# EAGLE design Gadget-Box-teensy-modules (EAGLE 6.6.0)

## Sheet 1 of 2
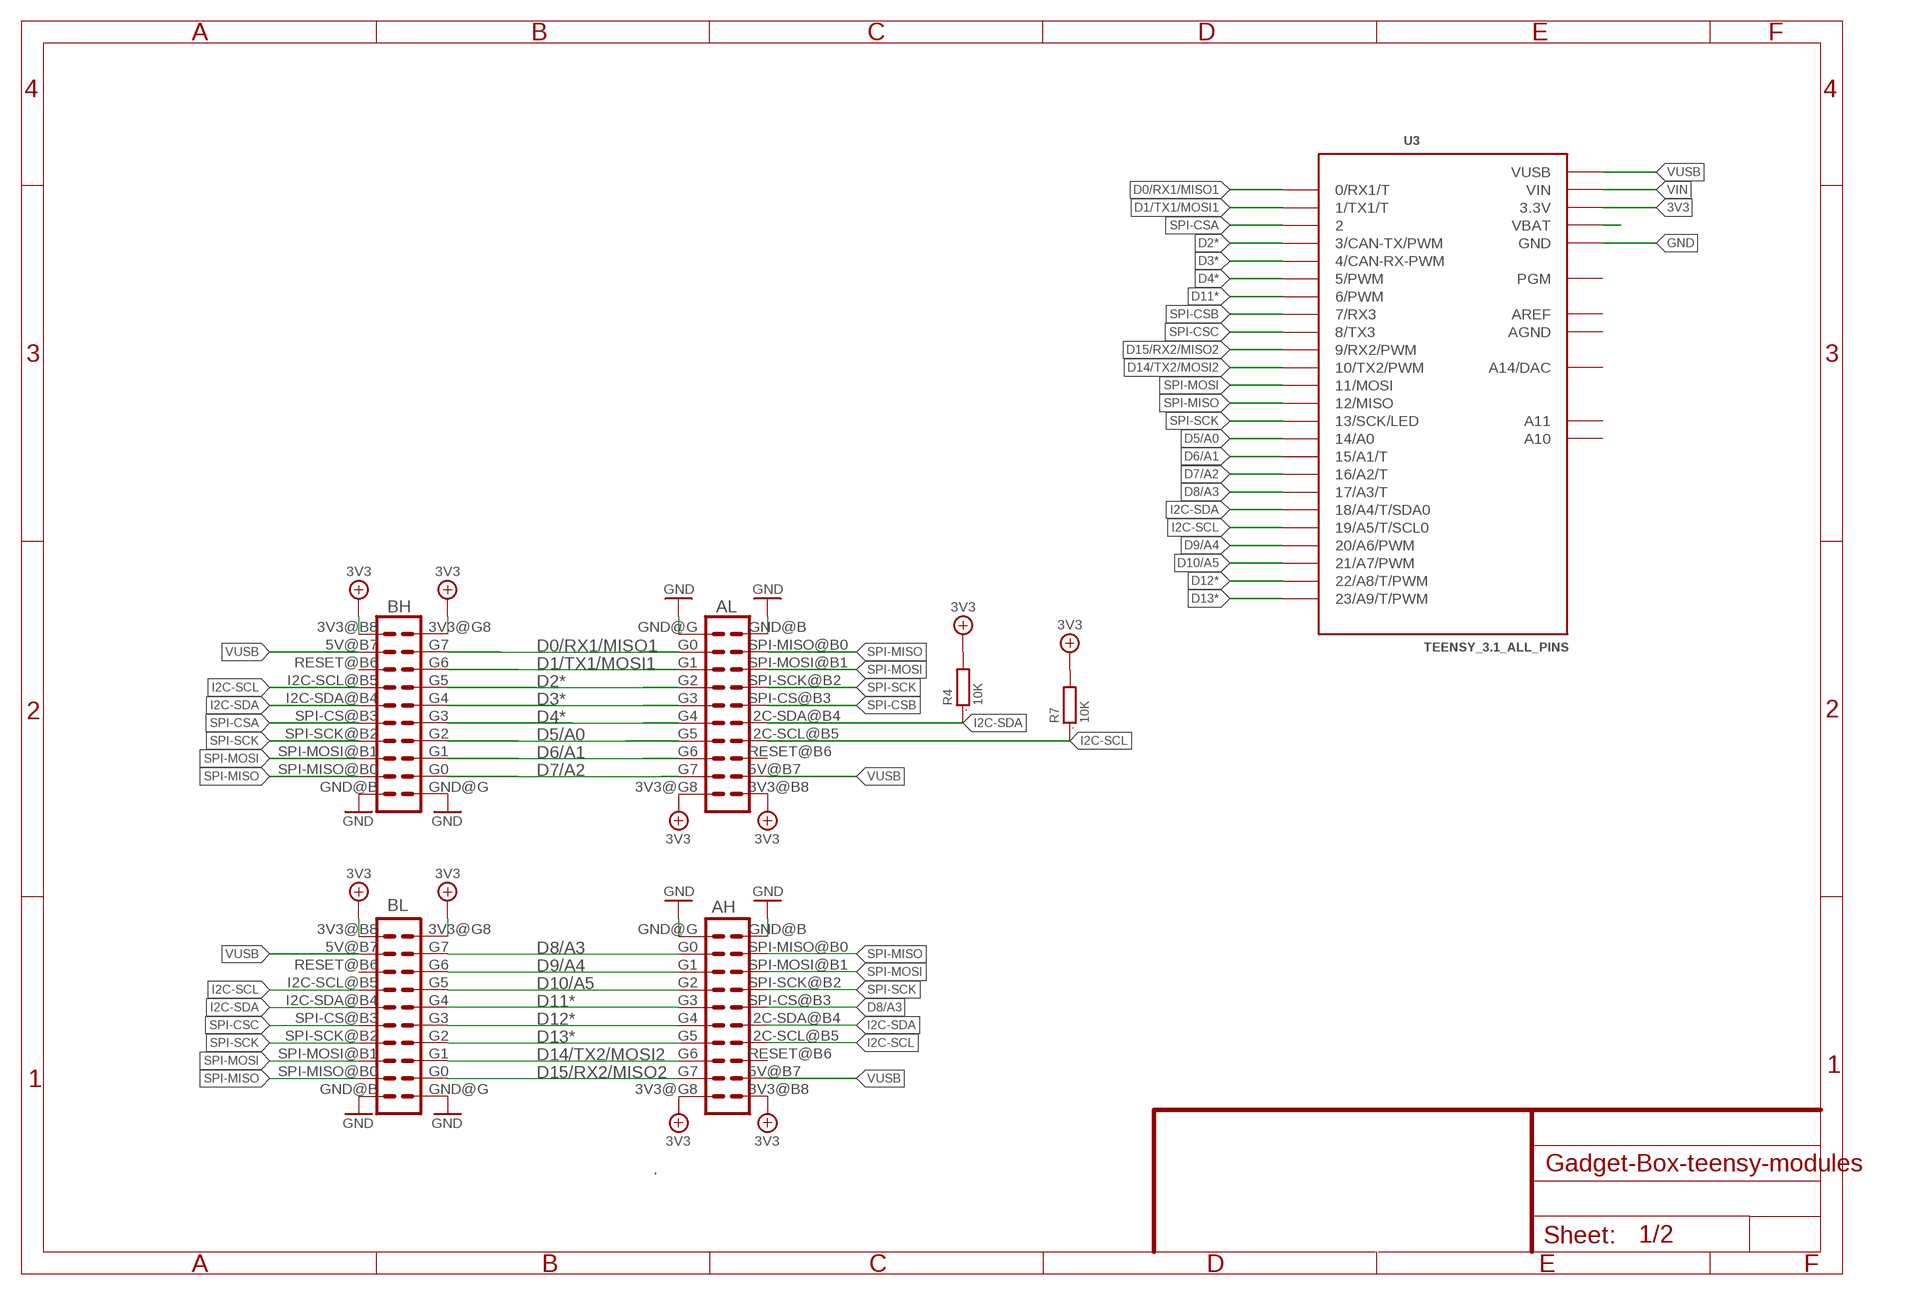
[diagram p0: schematic, sheet 1]

### Parts
AH  ECOGECOG_SLOT_ALT1  [ECOG_ALT1]
AL  ECOGECOG_SLOT_ALT1  [ECOG_ALT1]
BH  ECOGECOG_SLOT_ALT1  [ECOG_ALT1]
BL  ECOGECOG_SLOT_ALT1  [ECOG_ALT1]
R4  10K  R0603  [0603]
R7  10K  R0603  [0603]
U3  TEENSY_3.1_ALL_PINS  [TEENSY3-ALL_PINS]

### Nets
3V3: AH.3V3@B8(3V3) AH.3V3@G8(3V3) AL.3V3@B8(3V3) AL.3V3@G8(3V3) BH.3V3@B8(3V3) BH.3V3@G8(3V3) BL.3V3@B8(3V3) BL.3V3@G8(3V3) R4.2 R7.2 U3.3.3V U3.3.3V1(3.3V)
D0/RX1/MISO1: AL.G0 BH.G7 U3.0(0/RX1/T)
D1/TX1/MOSI1: AL.G1 BH.G6 U3.1(1/TX1/T)
D2*: AL.G2 BH.G5 U3.3(3/CAN-TX/PWM)
D3*: AL.G3 BH.G4 U3.4(4/CAN-RX-PWM)
D4*: AL.G4 BH.G3 U3.5(5/PWM)
D5/A0: AL.G5 BH.G2 U3.14/A0 ; also sheet 2
D6/A1: AL.G6 BH.G1 U3.15/A1(15/A1/T)
D7/A2: AL.G7 BH.G0 U3.16/A2(16/A2/T)
D8/A3: AH.G0 AH.SPI-CS@B3(SPI-CS) BL.G7 U3.17/A3(17/A3/T)
D9/A4: AH.G1 BL.G6 U3.20/A6(20/A6/PWM)
D10/A5: AH.G2 BL.G5 U3.21/A7(21/A7/PWM)
D11*: AH.G3 BL.G4 U3.6(6/PWM)
D12*: AH.G4 BL.G3 U3.22/A8(22/A8/T/PWM)
D13*: AH.G5 BL.G2 U3.23/A9(23/A9/T/PWM)
D14/TX2/MOSI2: AH.G6 BL.G1 U3.10(10/TX2/PWM)
D15/RX2/MISO2: AH.G7 BL.G0 U3.9(9/RX2/PWM)
GND [gnd]: AH.GND@B(GND) AH.GND@G(GND) AL.GND@B(GND) AL.GND@G(GND) BH.GND@B(GND) BH.GND@G(GND) BL.GND@B(GND) BL.GND@G(GND) U3.GND U3.GND1(GND) ; also sheet 2
I2C-SCL: AH.I2C-SCL@B5(I2C-SCL) AL.I2C-SCL@B5(I2C-SCL) BH.I2C-SCL@B5(I2C-SCL) BL.I2C-SCL@B5(I2C-SCL) R7.1 U3.19/A5(19/A5/T/SCL0)
I2C-SDA: AH.I2C-SDA@B4(I2C-SDA) AL.I2C-SDA@B4(I2C-SDA) BH.I2C-SDA@B4(I2C-SDA) BL.I2C-SDA@B4(I2C-SDA) R4.1 U3.18/A4(18/A4/T/SDA0)
SPI-CSA: BH.SPI-CS@B3(SPI-CS) U3.2
SPI-CSB: AL.SPI-CS@B3(SPI-CS) U3.7(7/RX3)
SPI-CSC: BL.SPI-CS@B3(SPI-CS) U3.8(8/TX3)
SPI-MISO: AH.SPI-MISO@B0(SPI-MISO) AL.SPI-MISO@B0(SPI-MISO) BH.SPI-MISO@B0(SPI-MISO) BL.SPI-MISO@B0(SPI-MISO) U3.12(12/MISO)
SPI-MOSI: AH.SPI-MOSI@B1(SPI-MOSI) AL.SPI-MOSI@B1(SPI-MOSI) BH.SPI-MOSI@B1(SPI-MOSI) BL.SPI-MOSI@B1(SPI-MOSI) U3.11(11/MOSI)
SPI-SCK: AH.SPI-SCK@B2(SPI-SCK) AL.SPI-SCK@B2(SPI-SCK) BH.SPI-SCK@B2(SPI-SCK) BL.SPI-SCK@B2(SPI-SCK) U3.13(13/SCK/LED)
VBAT: U3.VBAT
VIN: U3.VIN ; also sheet 2
VUSB: AH.5V@B7(5V) AL.5V@B7(5V) BH.5V@B7(5V) BL.5V@B7(5V) U3.VUSB ; also sheet 2
Unconnected: AH.RESET@B6(RESET) AL.RESET@B6(RESET) BH.RESET@B6(RESET) BL.RESET@B6(RESET) U3.A10 U3.A11 U3.PGM U3.RESET/DAC(A14/DAC)

## Sheet 2 of 2
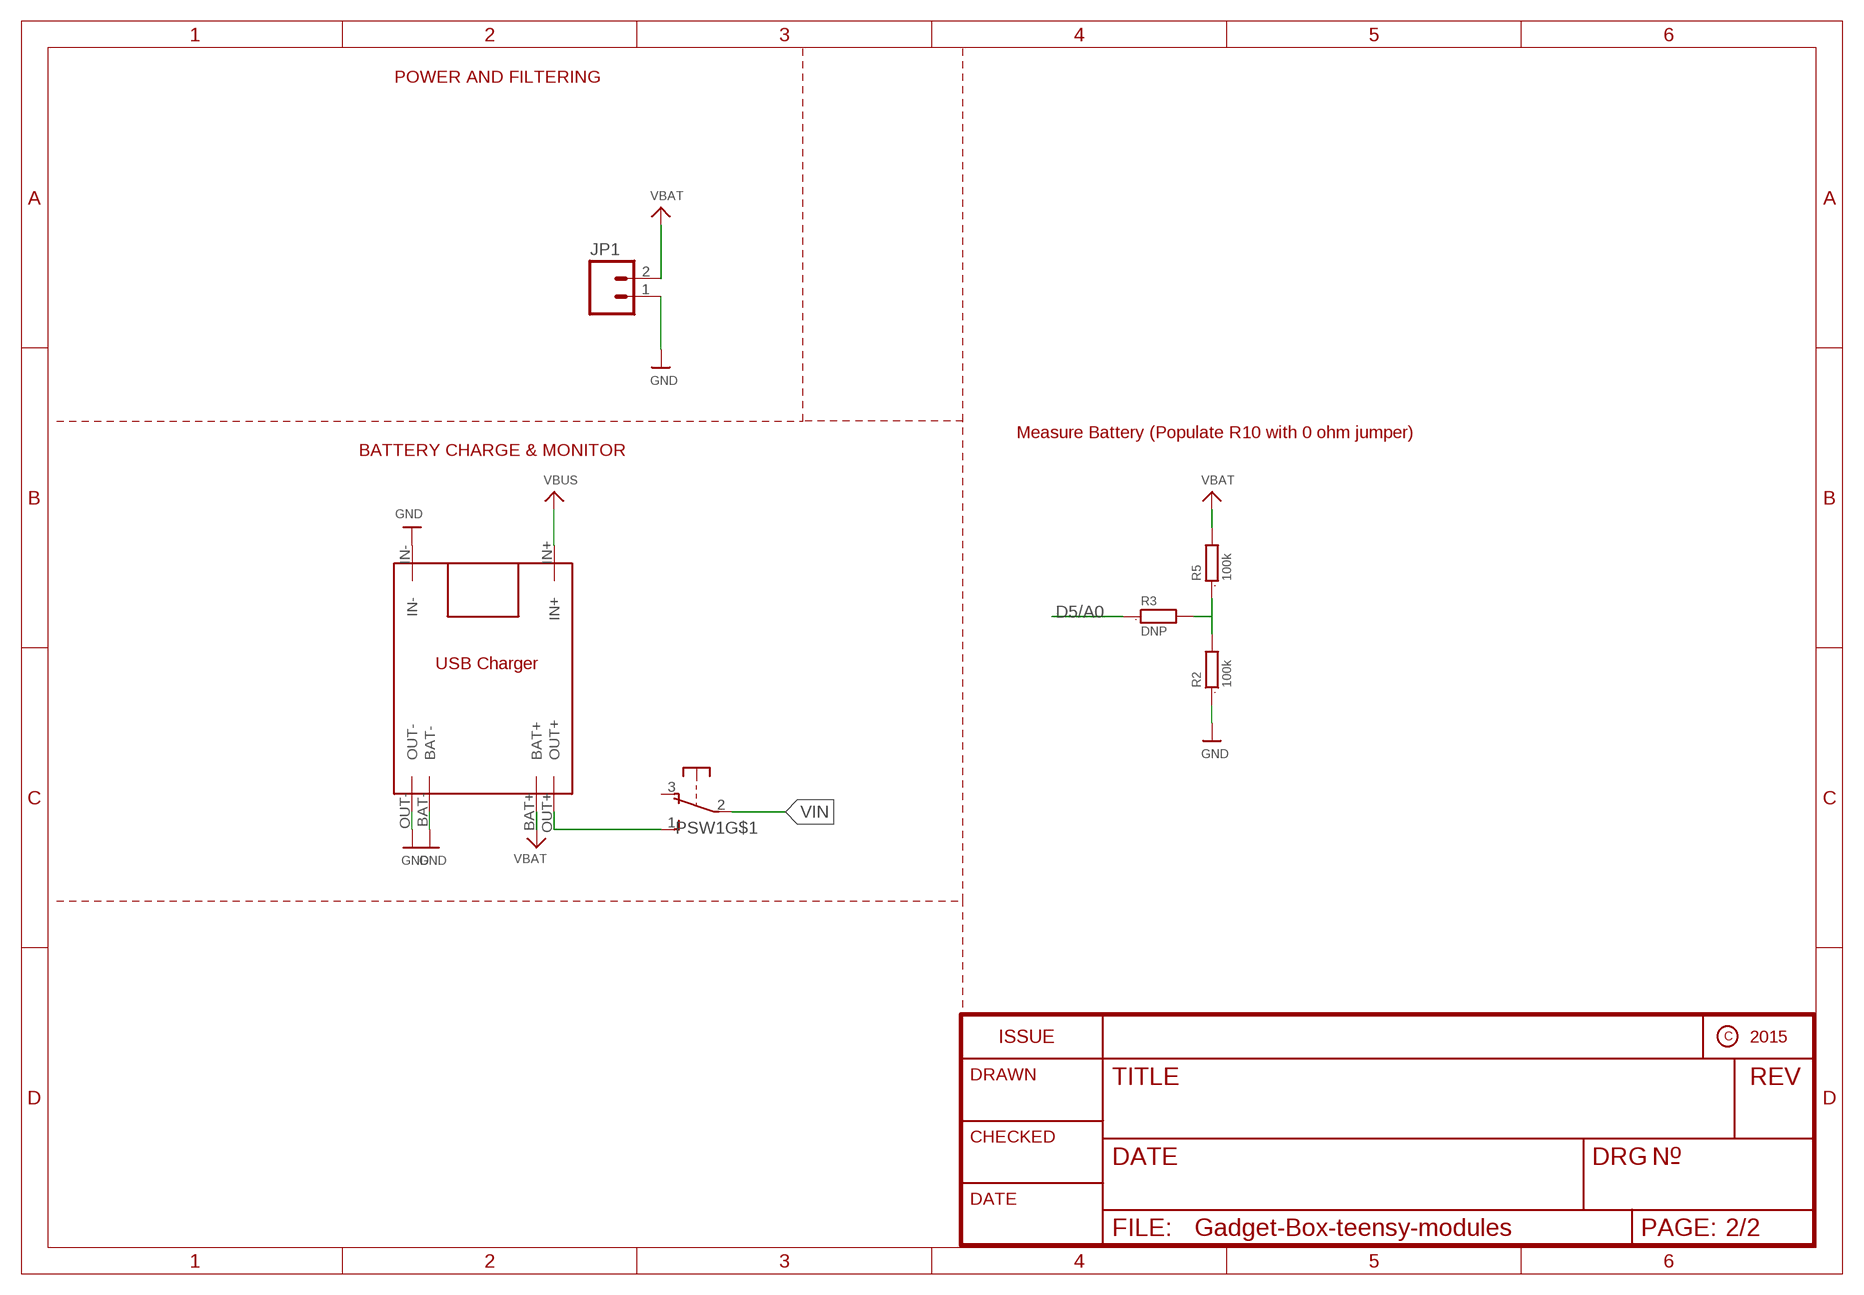
[diagram p1: schematic, sheet 2]

### Parts
JP1  M02-JST-2-PTH-NO_SILK  [JST-2-PTH-NS]
PSW1  OS102011MA1Q  [OS102011MA1Q]
R2  100k  R0603  [0603]
R3  DNP  R0603  [0603]
R5  100k  R0603  [0603]
U$1  TP4056  [TP4056]

### Nets
D5/A0: R3.1 ; also sheet 1
GND [gnd]: JP1.1 R2.1 U$1.BAT- U$1.IN- U$1.OUT- ; also sheet 1
N$2: R2.2 R3.2 R5.1
VBATTTERY: JP1.2 R5.2 U$1.BAT+ ; supply symbol labelled VBAT
VIN: PSW1.2(P) ; also sheet 1
VOUT: PSW1.1(S) U$1.OUT+
VUSB: U$1.IN+ ; supply symbol labelled VBUS ; also sheet 1
Unconnected: PSW1.3(O) PSW1.MT1(MT) PSW1.MT2(MT)

### Notes on the sheet
- POWER AND FILTERING
- Measure Battery (Populate R10 with 0 ohm jumper)
- BATTERY CHARGE & MONITOR

## Power pins joined to a net without a drawn wire
AGND: U3.AGND
AREF: U3.AREF

## Library data of the parts
AH AL BH BL = eCogs:ECOG; PARTNO: PPPC102LFBN-RC,SULLINS CONNECTOR SOLUTIONS,dk,S6106-ND,"CONN HEADER FEM 20POS.1"" DL GOLD", REF67
JP1 = SparkFun:M02: Header 2 Standard 2-pin 0.1" header. Use with straight break away headers (SKU : PRT-00116), right angle break away headers (PRT-00553), swiss pins (PRT-00743), machine pins (PRT-00117), and female headers (PRT-00115). Molex polarized connector foot print use with SKU : PRT-08233 with associated crimp pins and housings.; PARTNO: B2B-PH-SM4-TB(LF)(SN),JST SALES AMERICA INC (VA),dk,455-1734-1-ND ,"2 Positions Header, Shrouded Connector 0.079 (2.00mm) Through Hole Tin ", REF87
PSW1 = adafruit:OS102011MA1Q: OS10201MA1Q through-hole right angle switch http://www.ladyada.net/library/eagle; PARTNO: OS102011MA1QN1,C&K Components,dk,CKN9559-ND,SWITCH SLIDE SPDT 100MA 12V , REF72
R2 R5 = GadgetFactory:R: RESISTOR, European symbol; PARTNO: RC0603JR-07100KL,YAGEO (VA),dk,311-100KGRCT-ND,RES SMD 100K OHM 5% 1/10W 0603 , REF76
R3 = GadgetFactory:R: RESISTOR, European symbol; BOM: EXCLUDE
R4 R7 = GadgetFactory:R: RESISTOR, European symbol; PARTNO: RC0603JR-0710KL,YAGEO (VA),dk,311-10KGRCT-ND,RES SMD 10K OHM 5% 1/10W 0603 , REF36
U3 = Teensy_3_and_LC_Series_Boards_v1.1:TEENSY_3.1_ALL_PINS: Footprint for Teensy 3.1 or 3.2 board using all through-holes, i.e. the entire perimeter plus the 4 through-holes inboard (A10,A11,AREF, VUSB); BOM: EXCLUDE
U$1 = TP4056 charging module:TP4056

## Net classes
2 gnd: width 0.254 mm, drill 0.381 mm, clearance 0.254 mm
3 usbvcc: width 0.254 mm, drill 0.381 mm, clearance 0.254 mm
4 aref: width 0.254 mm, drill 0.381 mm, clearance 0.254 mm

## Board
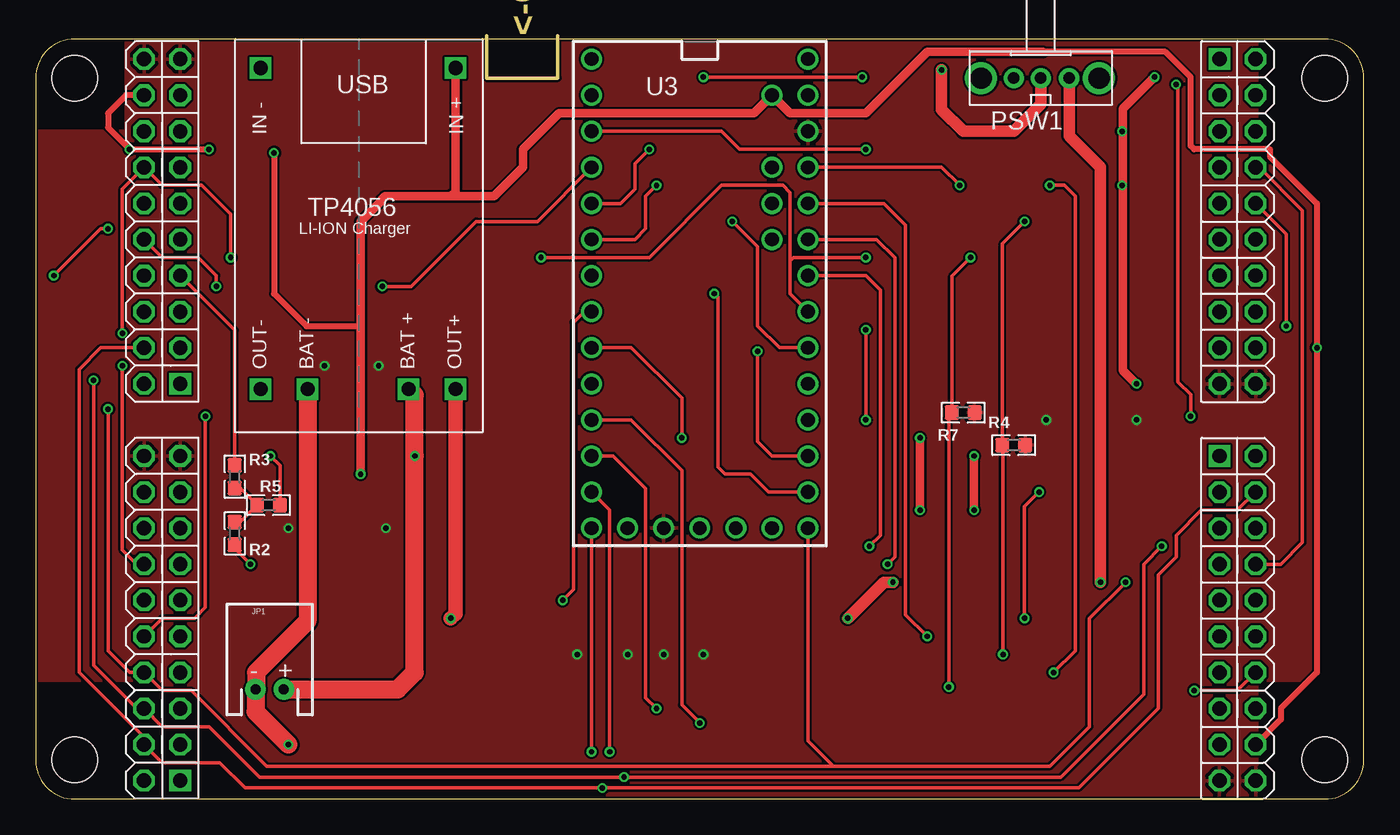
[diagram p2: board, top side]
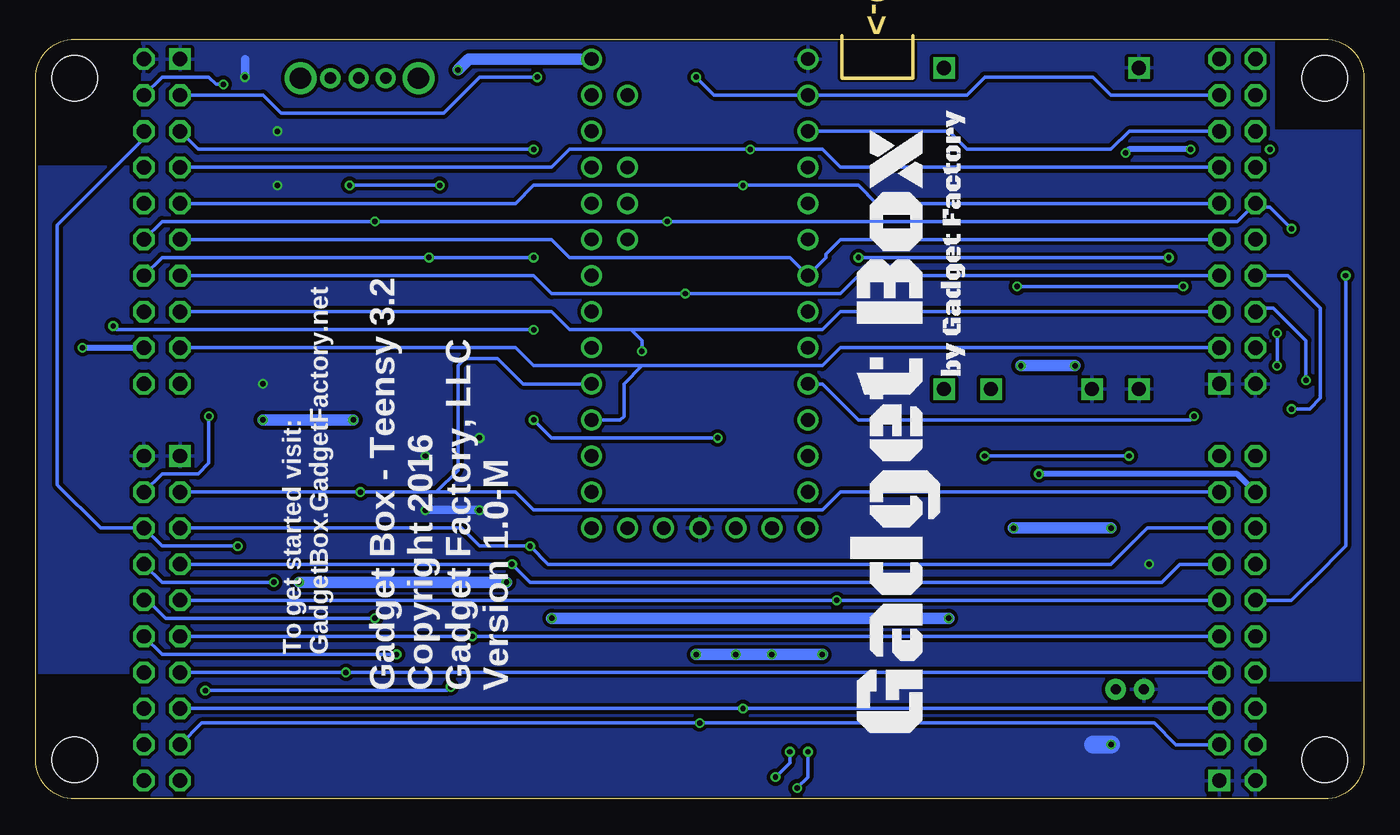
[diagram p3: board, bottom side, seen from below]

Size 93.5 x 53.75 mm. Coordinates in mm from the lower left corner, seen from the top.
Outline: 31.75,53.75 31.75,50.75 36.75,50.75 36.75,53.75
Copper layers (1*16): Top 0.035mm / dielectric 1.5mm / Bottom 0.035mm
Design rules "hackvana *": minimum track width 6mil, minimum drill 0.3mm, track to track 6mil, track to pad 6mil, pad to pad 6mil, via to via 6mil, smd to smd 0mil, copper to edge 6mil, drill to drill 6mil, minimum pad ring 10mil, minimum via ring 6mil, stop-mask expansion 2mil, vias tented up to drill 100mil, thermal gap 10mil

### Footprints (pad centres in the part's own frame; a part is rotated, then mirrored left to right if it is on the bottom)
ECOG93P53P5 = hole 3.2: 4,4; 92,4; 92,52; 4,52
ECOG_ALT1 = drill 1.016 octagon: 3V3@B8 21.59,3.81; 3V3@G8 21.59,1.27; 5V@B7 19.05,3.81; G0 1.27,1.27; G1 3.81,1.27; G2 6.35,1.27; G3 8.89,1.27; G4 11.43,1.27; G5 13.97,1.27; G6 16.51,1.27; G7 19.05,1.27; GND@B -1.27,3.81; I2C-SCL@B5 13.97,3.81; I2C-SDA@B4 11.43,3.81; RESET@B6 16.51,3.81; SPI-CS@B3 8.89,3.81; SPI-MISO@B0 1.27,3.81; SPI-MOSI@B1 3.81,3.81; SPI-SCK@B2 6.35,3.81 | drill 1.016 square: GND@G -1.27,1.27
JST-2-PTH-NS = drill 0.7 pad 1.448: 1 -1,0; 2 1,0
OS102011MA1Q = drill 0.8 pad 1.422: 1 -2,0; 2 0,0; 3 1.9,0 | drill 1.5 pad 2.184: MT1 -4.1,0; MT2 4.2,0
0603 = smd 1 x 1: 1 -0.8,0; 2 0.8,0
TEENSY3-ALL_PINS = drill 0.965: 0 -7.62,13.97; 1 -7.62,11.43; 2 -7.62,8.89; 3 -7.62,6.35; 3.3V 7.62,11.43; 3.3V1 -2.54,-16.51; 4 -7.62,3.81; 5 -7.62,1.27; 6 -7.62,-1.27; 7 -7.62,-3.81; 8 -7.62,-6.35; 9 -7.62,-8.89; 10 -7.62,-11.43; 11 -7.62,-13.97; 12 -7.62,-16.51; 13 7.62,-16.51; 14/A0 7.62,-13.97; 15/A1 7.62,-11.43; 16/A2 7.62,-8.89; 17/A3 7.62,-6.35; 18/A4 7.62,-3.81; 19/A5 7.62,-1.27; 20/A6 7.62,1.27; 21/A7 7.62,3.81; 22/A8 7.62,6.35; 23/A9 7.62,8.89; A10 5.08,6.35; A11 5.08,3.81; AGND 7.62,13.97; AREF 5.08,8.89; GND -7.62,16.51; GND1 0,-16.51; PGM 2.54,-16.51; RESET/DAC 5.08,-16.51; VBAT -5.08,-16.51; VIN 7.62,16.51; VUSB 5.08,13.97
TP4056 = drill 1 pad 1.422 square: BAT+ 3.505,-8.89; BAT- -3.607,-8.89; IN+ 6.807,13.716; IN- -6.909,13.716; OUT+ 6.807,-8.89; OUT- -6.909,-8.89

### Placement (x,y rotation side)
$$U$1  [ECOG93P53P5]  -1.25,-1.25 0 top
AH  82.06,22.88 270 top
AL  82.06,50.82 270 top
BH  11.45,30.5 90 top
BL  11.45,2.56 90 top
JP1  16.48,7.72 0 top
PSW1  70.75,50.75 180 top
R2  14.02,18.69 90 top
R3  14.02,22.69 270 top
R4  68.85,24.91 0 top
R5  16.4,20.69 0 top
R7  65.3,27.2 0 top
U3  46.75,35.58 0 top
U$1  22.75,37.75 0 top
U$100  [GADGETBOX_TEXT]  32.79,25.93 90 bottom

### Tracks (layer width: path | path; a pad name or v marks a point on that pad's centre or on a via)
3V3  (via drill 0.38)
  Bottom 0.813: v47.01,10.18 v44.22,10.18 v41.68,10.18 v38.12,10.18 | v77.49,26.69 v71.14,26.69 | v24.15,30.5 v20.34,30.5 | v24.66,19.07 v17.8,19.07
  pour Top: -1.25,8.37 -1.25,47.03 6.37,47.03 6.37,54.63 85.95,54.63 85.95,45.01 94.92,45.01 94.92,8.37 85.95,8.37 85.95,-1.25 7.64,-1.25 7.64,8.37
D0/RX1/MISO1  (via drill 0.38)
  Top 0.254: v47.01,50.82 v58.19,50.82
  Bottom 0.254: AL.G0 77.49,49.55 76.22,48.28 64.79,48.28 62.25,50.82 v58.19,50.82 | v47.01,50.82 45.74,49.55 U3.0 31.77,49.55 30.5,49.55 27.96,49.55 26.69,50.82 19.07,50.82 17.8,49.55 BH.G7
D1/TX1/MOSI1  (via drill 0.38)
  Top 0.254: v58.44,45.74 49.55,45.74 48.28,47.01 U3.1
  Bottom 0.254: BH.G6 16.53,47.01 17.8,45.74 27.96,45.74 29.23,47.01 U3.1 | v58.44,45.74 82.06,45.74 AL.G1
D2*  (via drill 0.38)
  Top 0.254: v43.2,45.74 42.18,44.72 42.18,42.95 41.17,41.93 U3.3
  Bottom 0.254: AL.G2 57.17,44.47 55.9,45.74 v43.2,45.74 38.12,45.74 36.85,44.47 BH.G5
D3*  (via drill 0.38)
  Top 0.254: v43.71,43.2 42.95,42.44 42.95,40.15 42.18,39.39 U3.4
  Bottom 0.254: BH.G4 34.31,41.93 35.58,43.2 v43.71,43.2 58.44,43.2 59.71,41.93 AL.G3
D4*
  Bottom 0.254: BH.G3 36.85,39.39 37.87,38.37 37.87,38.11 U3.5 40.4,38.12 55.9,38.12 57.17,39.39 AL.G4
D5/A0  (via drill 0.38)
  Top 0.254: R3.1 14.02,33.01 BH.G2 | v47.77,35.58 48.03,35.33 48.03,23.39 48.53,22.88 50.31,22.88 51.58,21.61 U3.14/A0
  Bottom 0.254: BH.G2 35.58,36.85 36.85,35.58 v47.77,35.58 57.17,35.58 58.44,36.85 AL.G5
D6/A1  (via drill 0.38)
  Top 0.254: v50.82,31.52 50.82,25.17 51.84,24.15 U3.15/A1
  Bottom 0.254: AL.G6 57.17,34.31 55.9,33.04 51.58,33.04 | 51.58,33.04 38.12,33.04 36.85,34.31 BH.G1 | v50.82,31.52 50.82,32.28 51.58,33.04
D7/A2
  Bottom 0.254: BH.G0 36.85,31.77 38.12,30.5 50.82,30.5 | AL.G7 59.71,31.77 58.44,30.5 50.82,30.5 | 50.82,30.5 52.09,29.23 52.09,26.94 52.34,26.69 U3.16/A2
D8/A3  (via drill 0.38)
  Top 0.254: v69.62,12.72 69.62,20.59 v70.63,21.61
  Bottom 0.254: AH.G0 v70.63,21.61 65.3,21.61 | AH.SPI-CS@B3 85.62,13.99 84.35,12.72 v69.62,12.72 | BL.G7 36.85,21.61 38.12,20.34 58.44,20.34 59.71,21.61 65.3,21.61 | 65.3,21.61 63.77,23.13 63.77,30.5 63.27,31.01 60.98,31.01 59.2,29.23 U3.17/A3
D9/A4  (via drill 0.38)
  Top 0.254: v58.69,17.8 59.46,18.56 59.46,35.83 58.44,36.85 U3.20/A6
  Bottom 0.254: BL.G6 15.26,19.07 17.8,16.53 57.42,16.53 v58.69,17.8 62.25,17.8 63.52,19.07 AH.G1
D10/A5  (via drill 0.38)
  Top 0.254: v59.96,16.53 60.47,17.04 60.47,38.12 59.2,39.39 U3.21/A7
  Bottom 0.254: AH.G2 v59.96,16.53 58.69,15.26 14.24,15.26 12.97,16.53 BL.G5
D11*  (via drill 0.38)
  Top 0.254: v37.1,13.99 37.87,14.75 37.87,33.55 38.63,34.31 U3.6
  Bottom 0.254: BL.G4 v37.1,13.99 AH.G3
D12*  (via drill 0.38)
  Top 0.254: v62.76,11.45 61.23,12.97 61.23,40.41 59.71,41.93 U3.22/A8
  Bottom 0.254: AH.G4 v62.76,11.45 BL.G3
D13*  (via drill 0.38)
  Top 0.254: v65.04,43.2 63.77,44.47 U3.23/A9 | v71.39,43.2 72.41,43.2 73.17,42.44 73.17,10.43 v71.65,8.91
  Bottom 0.254: BL.G2 v71.65,8.91 AH.G5 | v65.04,43.2 v71.39,43.2
D14/TX2/MOSI2  (via drill 0.38)
  Top 0.254: v43.71,6.37 42.95,7.13 42.95,21.86 40.66,24.15 U3.10
  Bottom 0.254: AH.G6 v43.71,6.37 BL.G1
D15/RX2/MISO2  (via drill 0.38)
  Top 0.254: v46.76,5.35 45.49,6.62 45.49,23.13 41.93,26.69 U3.9
  Bottom 0.254: BL.G0 13.23,3.83 14.75,5.35 v46.76,5.35 81.81,5.35 AH.G7
GND  (via drill 0.38)
  Top 0.254: R2.1 14.02,17.64 v15.13,16.53
  Top 0.61: v77.49,29.23 76.54,30.18 76.54,48.6 v78.76,50.82 | v62.25,25.42 v62.25,20.34 | v66.06,20.34 v66.06,24.15
  Top 1.27: U$1.BAT- 19.14,12.54 15.51,8.91 15.51,7.76 JP1.1 15.48,6.15 v17.8,3.83
  Bottom 0.254: v15.13,16.53 15.26,16.53
  Bottom 0.61: v62.25,20.34 v66.06,20.34 | v78.76,50.82 78.76,52.09
  Bottom 1.27: v17.8,3.83 19.07,3.83
  other vias: 76.47,43.2 76.47,47.01
  pour Bottom: -1.25,8.4 -1.25,47.01 6.37,47.01 6.37,55.14 85.95,55.14 85.95,44.47 94.92,44.47 94.92,8.91 85.95,8.91 85.95,-1.76 7.64,-1.76 7.64,8.4
I2C-SCL  (via drill 0.38)
  Top 0.254: v13.74,38.12 13.74,41.17 11.7,43.2 8.91,43.2 BH.I2C-SCL@B5 6.12,42.95 v6.12,32.79 | BL.I2C-SCL@B5 7.13,16.53 6.12,17.55 v6.12,30.5 | AH.I2C-SCL@B5 84.6,7.64 v81.55,7.64 | v65.81,38.12 64.5,36.81 R7.1 64.28,26.98 v64.28,7.89 | v35.58,38.12 43.2,38.12 48.28,43.2 52.6,43.2 53.11,42.69 53.11,37.87 | 53.11,37.87 53.11,35.57 U3.19/A5 | v58.44,38.12 53.36,38.12 53.11,37.87
  Bottom 0.254: AL.I2C-SCL@B5 84.6,38.12 v65.81,38.12 v58.44,38.12 | v6.12,30.5 v6.12,32.79 | v81.55,7.64 64.54,7.64 v64.28,7.89 | v35.58,38.12 v13.74,38.12
I2C-SDA  (via drill 0.38)
  Top 0.254: v68.09,10.18 68.09,24.87 R4.1 68.05,39.1 v69.62,40.66 | v49.04,40.66 50.82,38.88 50.82,33.29 52.34,31.77 U3.18/A4 | v5.1,40.15 4.59,40.15 v1.29,36.85
  Bottom 0.254: AL.I2C-SDA@B4 84.6,40.66 v69.62,40.66 v49.04,40.66 8.91,40.66 BH.I2C-SDA@B4 7.39,41.68 6.62,41.68 v5.1,40.15 | BL.I2C-SDA@B4 5.1,13.99 2.56,16.53 2.31,16.78 1.29,17.8 v1.29,36.85 | AH.I2C-SDA@B4 84.6,10.18 v68.09,10.18
N$2
  Top 0.254: R3.2 14.4,21.89 R5.1 14.4,19.49 R2.2
SPI-CSA  (via drill 0.38)
  Top 0.254: v24.4,36.09 26.44,36.09 31.01,40.66 35.32,40.66 U3.2 | v12.72,36.09 12.72,36.85 11.45,38.12 8.91,38.12 BH.SPI-CS@B3
  Bottom 0.254: v24.4,36.09 v12.72,36.09
SPI-CSB  (via drill 0.38)
  Top 0.254: v88.03,33.29 88.03,39.77 AL.SPI-CS@B3 | v58.44,26.69 v58.44,33.04 | U3.7 41.93,31.77 45.49,28.21 v45.49,25.42
  Bottom 0.254: v58.44,33.04 87.78,33.04 v88.03,33.29 | v45.49,25.42 57.17,25.42 v58.44,26.69
SPI-CSC  (via drill 0.38)
  Top 0.254: BL.SPI-CS@B3 8.91,12.72 11.2,12.72 11.96,13.48 v11.96,26.94
  Bottom 0.254: U3.8 38.12,29.23 35.58,26.69 12.21,26.69 v11.96,26.94
SPI-MISO  (via drill 0.38)
  Top 0.254: AH.SPI-MISO@B0 84.6,20.34 82.06,20.34 80.28,18.56 80.28,17.04 79.01,15.77 79.01,6.37 73.43,0.78 v39.9,0.78 14.75,0.78 12.97,2.56 8.91,2.56 BL.SPI-MISO@B0 7.64,4.34 3.07,8.91 3.07,30.25 4.59,31.77 BH.SPI-MISO@B0 | U3.12 v39.13,3.33 v39.14,3.32 | v81.3,26.94 81.3,28.47 80.41,29.36 80.41,50.19 v80.28,50.31
  Bottom 0.254: AL.SPI-MISO@B0 84.6,50.82 81.3,50.82 80.79,50.31 v80.28,50.31 | v81.3,26.94 81.3,23.64 82.06,22.88 84.6,22.88 AH.SPI-MISO@B0 | v39.14,3.32 39.14,1.54 v39.9,0.78
SPI-MOSI  (via drill 0.38)
  Top 0.254: v79.27,17.8 78,16.53 78,7.39 72.16,1.54 v41.42,1.54 15.77,1.54 12.21,5.1 8.91,5.1 BL.SPI-MOSI@B1 7.13,6.37 4.08,9.42 v4.08,29.48 | v40.41,3.32 40.41,20.33 U3.11
  Bottom 0.254: v79.27,17.8 84.6,17.8 AH.SPI-MOSI@B1 88.92,19.07 91.97,22.12 91.97,40.41 85.87,46.5 AL.SPI-MOSI@B1 | v4.08,29.48 4.08,32.28 6.37,34.56 7.39,34.56 BH.SPI-MOSI@B1 | v40.41,3.32 40.41,2.56 v41.42,1.54
SPI-SCK  (via drill 0.38)
  Top 0.254: 56.15,2.31 16.28,2.31 10.94,7.64 8.91,7.64 BL.SPI-SCK@B2 6.62,8.91 5.1,10.43 v5.1,27.45 | 56.15,2.31 71.39,2.31 74.19,5.1 74.19,12.72 v76.73,15.26 | AL.SPI-SCK@B2 86.13,44.47 89.17,41.42 89.17,18.05 87.65,16.53 AH.SPI-SCK@B2 | 56.15,2.31 54.37,4.09 U3.13
  Bottom 0.254: v76.73,15.26 84.6,15.26 AH.SPI-SCK@B2 | v5.1,27.45 3.83,27.45 3.07,28.21 3.07,34.56 5.35,36.85 BH.SPI-SCK@B2
VBATTTERY  (via drill 0.38)
  Top 0.254: R5.2 17.2,23.48 v16.53,24.15
  Top 1.27: JP1.2 25.5,7.72 26.69,8.91 v26.69,24.15 26.69,28.43 U$1.BAT+
  Bottom 0.254: v16.53,24.15 v26.69,24.15
VIN  (via drill 0.38)
  Top 0.61: PSW1.2
  Top 0.813: v63.77,51.33 63.77,48.53 65.3,47.01 68.85,47.01 70.76,48.91 PSW1.2
  Bottom 0.813: U3.VIN 63.01,52.09 v63.77,51.33
VOUT  (via drill 0.38)
  Top 0.813: v74.95,15.26 74.95,44.47 72.75,46.67 PSW1.1 | v60.34,15.26 59.71,15.26 v57.17,12.72
  Top 1.016: U$1.OUT+ 29.56,13.05 v29.23,12.72
  Bottom 0.813: v74.95,15.26 v60.34,15.26 | v57.17,12.72 v29.23,12.72
VUSB  (via drill 0.38)
  Top 0.406: 70.9,52.6 79.52,52.6 81.3,50.82 81.3,45.99 81.55,45.74 86.89,45.74 86.89,45.23 90.19,41.93 v90.19,31.77 90.19,8.91 87.65,6.37 87.65,5.61 AH.5V@B7 | v16.78,45.49 16.78,35.58 19.07,33.29 22.63,33.29 22.88,33.04 | v12.21,45.74 v6.62,45.74 5.1,47.26 5.1,48.28 6.37,49.55 BH.5V@B7
  Top 0.61: 70.9,52.6 62.76,52.6 58.44,48.28 53.1,48.28 U3.VUSB 50.56,48.28 36.85,48.28 34.31,45.74 34.31,44.47 32.28,42.44 29.23,42.44 | 29.23,42.44 24.6,42.44 24.35,42.18 24.35,42.13 22.88,40.66 22.88,33.04 v22.88,22.88 | U$1.IN+ 29.56,42.77 29.23,42.44
  Bottom 0.406: v12.21,45.74 16.53,45.74 v16.78,45.49 | BL.5V@B7 8.91,22.88 v22.88,22.88 | v90.19,31.77 AL.5V@B7

### Text on the board
Dimension: <-Cutout
bPlace: To get started visit: / GadgetBox.GadgetFactory.net | Gadget Box - Teensy 3.2 / Copyright 2016 / Gadget Factory, LLC / Version 1.0-M
Reference: TOP Silkscreen is on layer 200